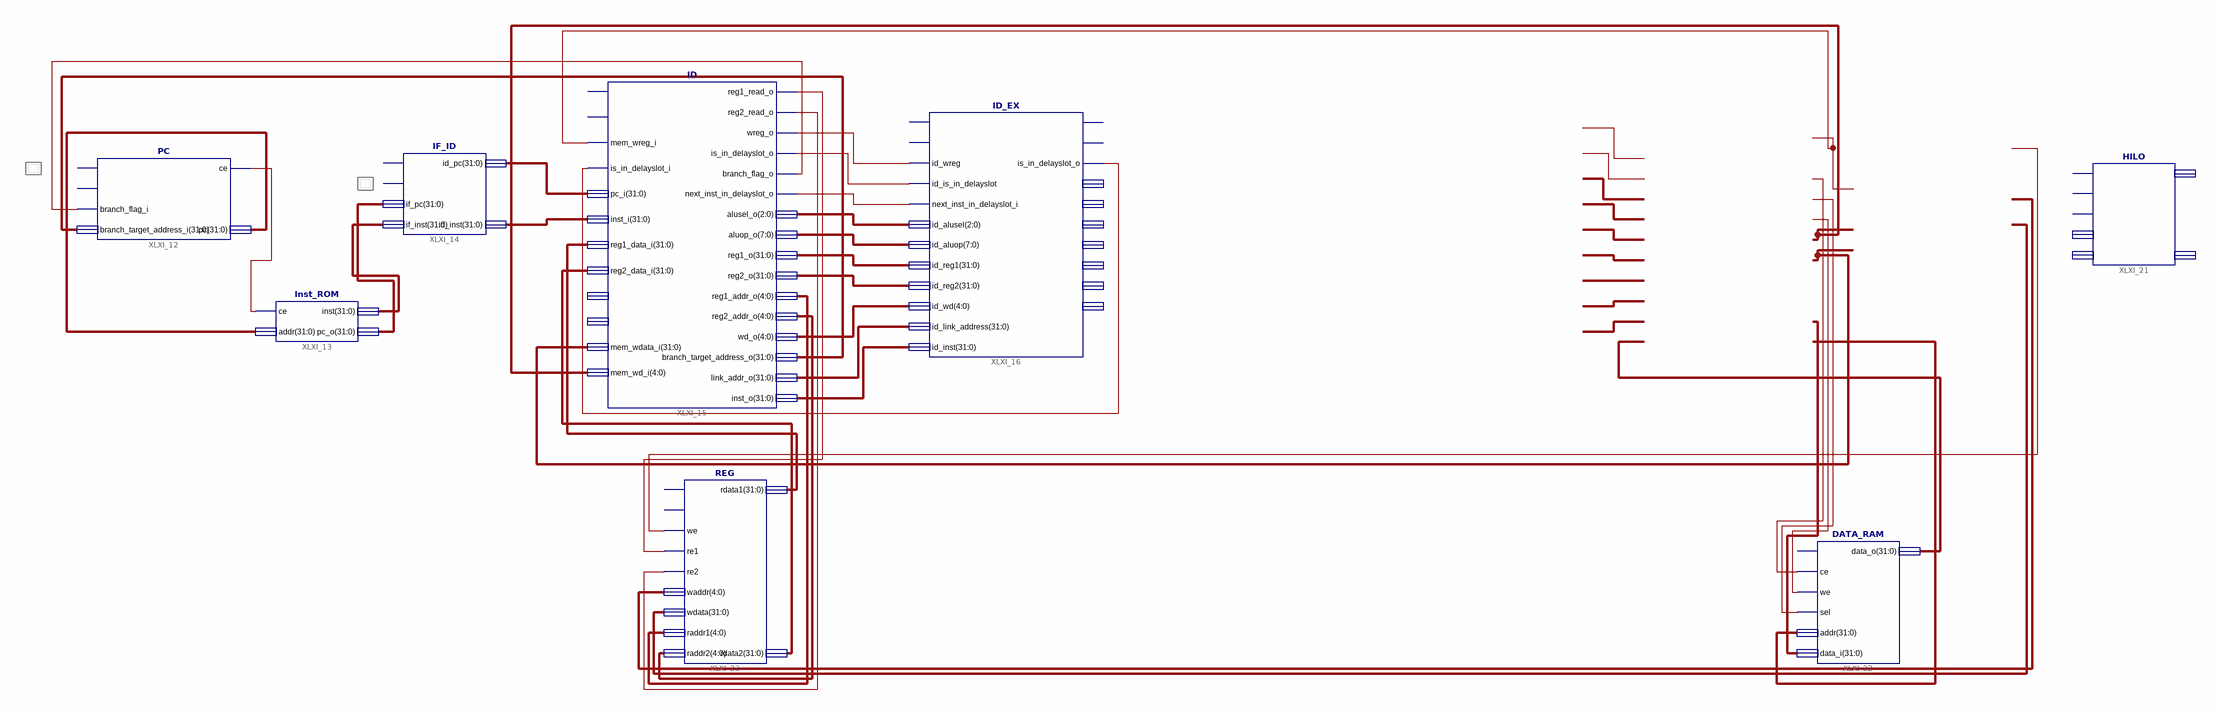
[diagram p0: schematic sheet 1]
// Xilinx ISE schematic MipsCPU.sch (spartan6) as structural Verilog: 8 symbols, 0 ports
module MipsCPU (
);

  wire XLXN_45, XLXN_51, XLXN_52, XLXN_53, XLXN_54, XLXN_55, XLXN_56, XLXN_74, XLXN_103, XLXN_104, XLXN_105,
       XLXN_113, XLXN_123;
  wire [2:0] XLXN_57;
  wire [4:0] XLXN_64, XLXN_66, XLXN_106, XLXN_115, XLXN_145;
  wire [7:0] XLXN_58;
  wire [31:0] XLXN_46, XLXN_49, XLXN_50, XLXN_61, XLXN_62, XLXN_68, XLXN_69, XLXN_70, XLXN_71, XLXN_100,
       XLXN_107, XLXN_110, XLXN_111, XLXN_116, XLXN_144, XLXN_150, XLXN_151;

  PC XLXI_12 (
    .branch_flag_i(XLXN_55), .branch_target_address_i(XLXN_144), .ce(XLXN_45), .pc(XLXN_46));  // open: clk, rst
  Inst_ROM XLXI_13 (.ce(XLXN_45), .addr(XLXN_46), .inst(XLXN_150), .pc_o(XLXN_151));
  IF_ID XLXI_14 (.if_pc(XLXN_151), .if_inst(XLXN_150), .id_pc(XLXN_49), .id_inst(XLXN_50));  // open: clk, rst
  ID XLXI_15 (
    .mem_wreg_i(XLXN_123), .is_in_delayslot_i(XLXN_74), .pc_i(XLXN_49), .inst_i(XLXN_50),
    .reg1_data_i(XLXN_70), .reg2_data_i(XLXN_71), .mem_wdata_i(XLXN_107), .mem_wd_i(XLXN_106),
    .reg1_read_o(XLXN_51), .reg2_read_o(XLXN_52), .wreg_o(XLXN_53), .is_in_delayslot_o(XLXN_54),
    .branch_flag_o(XLXN_55), .next_inst_in_delayslot_o(XLXN_56), .alusel_o(XLXN_57), .aluop_o(XLXN_58),
    .reg1_o(XLXN_61), .reg2_o(XLXN_62), .reg1_addr_o(XLXN_64), .reg2_addr_o(XLXN_145), .wd_o(XLXN_66),
    .branch_target_address_o(XLXN_144), .link_addr_o(XLXN_68), .inst_o(XLXN_69));  // open: rst, ex_wreg_i, ex_wdata_i, ex_wd_i
  ID_EX XLXI_16 (
    .id_wreg(XLXN_53), .id_is_in_delayslot(XLXN_54), .next_inst_in_delayslot_i(XLXN_56), .id_alusel(XLXN_57),
    .id_aluop(XLXN_58), .id_reg1(XLXN_61), .id_reg2(XLXN_62), .id_wd(XLXN_66), .id_link_address(XLXN_68),
    .id_inst(XLXN_69), .is_in_delayslot_o(XLXN_74));  // open: clk, rst, ex_wreg, ex_is_in_delayslot, ex_alusel, ex_aluop, ex_reg1, ex_reg2, ex_wd, ex_link_address, ex_inst
  HILO XLXI_21 ();  // open: clk, rst, we, hi_i, lo_i, hi_o, lo_o
  DATA_RAM XLXI_22 (
    .ce(XLXN_103), .we(XLXN_105), .sel(XLXN_104), .addr(XLXN_111), .data_i(XLXN_110), .data_o(XLXN_100));  // open: clk
  REG XLXI_23 (
    .we(XLXN_113), .re1(XLXN_51), .re2(XLXN_52), .waddr(XLXN_115), .wdata(XLXN_116), .raddr1(XLXN_64),
    .raddr2(XLXN_145), .rdata1(XLXN_70), .rdata2(XLXN_71));  // open: clk, rst
endmodule
